# Altium project PCB Project.PrjPcb
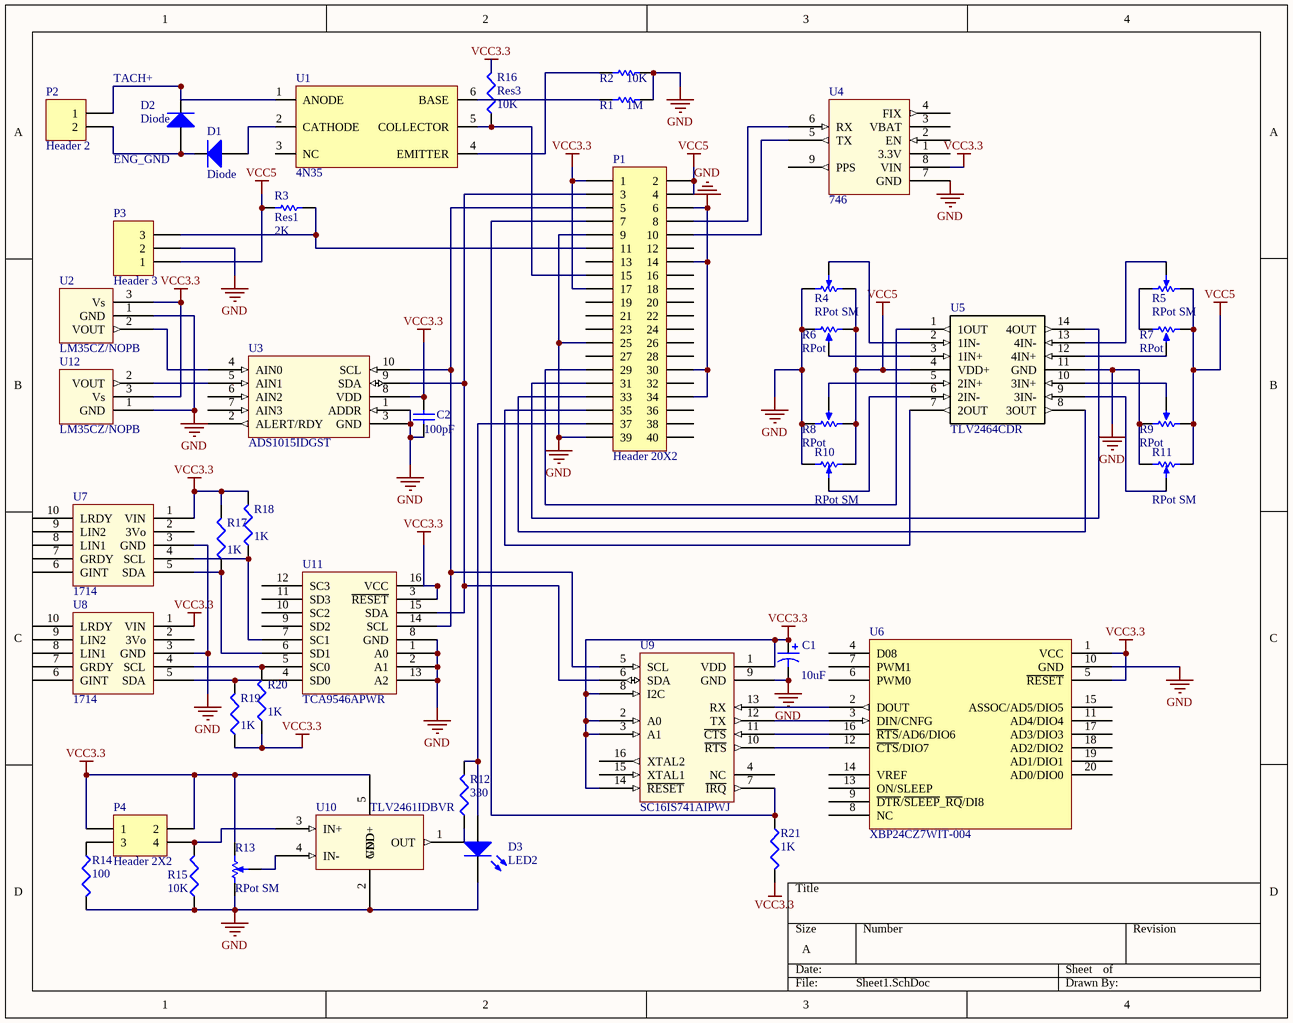
[diagram p0: Sheet1.SchDoc]
1 sheet, 42 parts. Net scope: global (net labels, ports and power ports of the same name join across sheets).
Board file: PCB1.PcbDoc

## Sheet Sheet1.SchDoc
size A

### Parts
C1  value 10uF  [C0805]  (hidden comment: Cap Pol3)
C2  value 100pF  [1608[0603]]  (hidden comment: Cap Semi)
D1  Diode  [DIODE-0.4]
D2  Diode  [DIODE-0.4]
D3  LED2  [3.2X1.6X1.1]
P1  Header 20X2  [HDR2X20]
P2  Header 2  [HDR1X2]
P3  Header 3  [HDR1X3]
P4  Header 2X2  [HDR2X2]
R1  value 1M  [0402]  (hidden comment: Res1)
R2  value 10K  [0402]  (hidden comment: Res1)
R3  Res1  value 2K  [0402]
R4  RPot SM  [23BR10KLFTR]
R5  RPot SM  [23BR10KLFTR]
R6  RPot  [VR5]
R7  RPot  [VR5]
R8  RPot  [VR5]
R9  RPot  [VR5]
R10  RPot SM  [23BR10KLFTR]
R11  RPot SM  [23BR10KLFTR]
R12  value 330  [0402]  (hidden comment: Res3)
R13  RPot SM  [23BR10KLFTR]
R14  value 100  [0402]  (hidden comment: Res3)
R15  value 10K  [0402]  (hidden comment: Res3)
R16  Res3  value 10K  [0402]
R17  value 1K  [J1-0603]  (hidden comment: Res3)
R18  value 1K  [J1-0603]  (hidden comment: Res3)
R19  value 1K  [J1-0603]  (hidden comment: Res3)
R20  value 1K  [J1-0603]  (hidden comment: Res3)
R21  value 1K  [J1-0603]  (hidden comment: Res3)
U1  4N35  [4N35]
U2  LM35CZ/NOPB  [HDR1X3]
U3  ADS1015IDGST  [ADS1015IDGST]
U4  746  [HDR1X9]
U5  TLV2464CDR  [TLV2464CDR]
U6  XBP24CZ7WIT-004  [XBP24CZ7WIT-004]
U7  1714  [HDR1X10]
U8  1714  [HDR1X10]
U9  SC16IS741AIPWJ  [SC16IS741AIPWJ]
U10  TLV2461IDBVR  [TLV2461IDBVR]
U11  TCA9546APWR  [TCA9546APWR]
U12  LM35CZ/NOPB  [HDR1X3]

### Nets
GND: C1.2 C2.1 D3.2(K) P1.6 P1.9 P1.14 P1.25 P1.30 P1.34 P1.39 P3.2 R1.1 R2.1 R4.1 R6.1(TOP) R8.2(BOT) R9.2(BOT) R10.3 R11.3 R13.3 R14.2 R15.1 U2.1(GND) U3.1(ADDR) U3.3(GND) U4.7(GND) U5.11(GND) U6.10(GND) U7.3(GND) U8.3(GND) U9.9(GND) U10.2(GND) U11.1(A0) U11.2(A1) U11.8(GND) U11.13(A2) U12.1(GND)
VCC3.3: C1.1 C2.2 P1.1 P1.17 P4.1 P4.2 R13.1 R16.2 R17.2 R18.2 R19.1 R20.1 R21.2 U2.3(Vs) U3.8(VDD) U4.8(VIN) U6.1(VCC) U6.5(~{RESET}) U7.1(VIN) U8.1(VIN) U9.1(VDD) U9.2(A0) U9.3(A1) U9.8(I2C) U9.14(~{RESET}) U10.5(VDD+) U11.3(~{RESET}) U11.16(VCC) U12.3(Vs)
VCC5: P1.2 P1.4 P3.1 R3.1 R4.3 R5.3 R6.2(BOT) R7.2(BOT) R8.1(TOP) R9.1(TOP) R10.1 R11.1 U5.4(VDD+)
NetD1_1: D1.1(A) U1.2(CATHODE)
NetD1_2: D1.2(K) D2.1(A) P2.2
NetD2_2: D2.2(K) P2.1 U1.1(ANODE)
NetD3_1: D3.1(A) P1.37 R12.2
NetP1_3: P1.3 U3.9(SDA) U9.6(SDA) U11.15(SDA)
NetP1_5: P1.5 U3.10(SCL) U9.5(SCL) U11.14(SCL)
NetP1_7: P1.7 R21.1 U9.7(~{IRQ})
NetP1_8: P1.8 U4.6(RX)
NetP1_10: P1.10 U4.5(TX)
NetP1_11: P1.11 P3.3 R3.2
NetP1_15: P1.15 R16.1 U1.5(COLLECTOR)
NetP1_29: P1.29 U5.1(1OUT)
NetP1_31: P1.31 U5.14(4OUT)
NetP1_33: P1.33 U5.8(3OUT)
NetP1_35: P1.35 U5.7(2OUT)
NetP4_3: P4.3 R14.1
NetP4_4: P4.4 R15.2 U10.3(IN+)
NetR1_2: R1.2 U1.6(BASE)
NetR2_2: R2.2 U1.4(EMITTER)
NetR4_2: R4.2 U5.2(1IN-)
NetR5_1: R5.1 R7.1(TOP)
NetR5_2: R5.2 U5.13(4IN-)
NetR6_3: R6.3(TAP) U5.3(1IN+)
NetR7_3: R7.3(TAP) U5.12(4IN+)
NetR8_3: R8.3(TAP) U5.5(2IN+)
NetR9_3: R9.3(TAP) U5.10(3IN+)
NetR10_2: R10.2 U5.6(2IN-)
NetR11_2: R11.2 U5.9(3IN-)
NetR12_1: R12.1 U10.1(OUT)
NetR13_2: R13.2 U10.4(IN-)
NetR17_1: R17.1 U7.5(SDA) U11.6(SD1)
NetR18_1: R18.1 U7.4(SCL) U11.7(SC1)
NetR19_2: R19.2 U8.5(SDA) U11.4(SD0)
NetR20_2: R20.2 U8.4(SCL) U11.5(SC0)
NetU2_2: U2.2(VOUT) U3.4(AIN0)
NetU3_5: U3.5(AIN1) U12.2(VOUT)
NetU6_2: U6.2(DOUT) U9.13(RX)
NetU6_3: U6.3(DIN/CNFG) U9.12(TX)
NetU6_12: U6.12(~{CTS}/DIO7) U9.10(~{RTS})
NetU6_16: U6.16(~{RTS}/AD6/DIO6) U9.11(~{CTS})

Not connected (* = marked no-connect by the designer): P1 12 13 16 18 19 20 21 22 23 24 26 27 28 32 36 38 40; U1 3(NC); U3 2(ALERT/RDY) 6(AIN2) 7(AIN3); U4 1(3.3V) 2(EN) 3(VBAT) 4(FIX) 9(PPS); U6 4(D08) 6(PWM0) 7(PWM1) 8(NC) 9(~{DTR}/~{SLEEP}_~{RQ}/DI8) 11(AD4/DIO4) 13(ON/SLEEP) 14(VREF) 15(ASSOC/AD5/DIO5) 17(AD3/DIO3) 18(AD2/DIO2) 19(AD1/DIO1) 20(AD0/DIO0); U7 2(3Vo) 6(GINT) 7(GRDY) 8(LIN1) 9(LIN2) 10(LRDY); U8 2(3Vo) 6(GINT) 7(GRDY) 8(LIN1) 9(LIN2) 10(LRDY); U9 4(NC) 15(XTAL1) 16(XTAL2); U11 9(SD2) 10(SC2) 11(SD3) 12(SC3)

### Notes on the sheet
- TACH+
- ENG_GND

### Library data of the parts
C1 = Cap Pol3: Polarized Capacitor (Surface Mount); Published: 8-Jun-2000; LatestRevisionDate: 29-May-2009; LatestRevisionNote: IPC-7351 Footprint Added.; PackageReference: C0805; Publisher: Altium Limited; PackageDescription: Chip Capacitor
C2 = Cap Semi: Capacitor (Semiconductor SIM Model); Published: 8-Jun-2000; LatestRevisionDate: 29-May-2009; LatestRevisionNote: IPC-7351 Footprint Added.; PackageReference: C1206; Publisher: Altium Limited; PackageDescription: Chip Capacitor
D1 D2 = Diode: Default Diode; Published: 8-Jun-2000; LatestRevisionDate: 17-Jul-2002; LatestRevisionNote: Re-released for DXP Platform.; PackageVersion: Sep-1996; PackageReference: SMC; Publisher: Altium Limited; PackageDescription: DO-214-AB/SMC; 2 C-Bend Leads; Body 7.9 x 5.9 mm, inc. leads (LxW); Code_JEDEC: DO-214-AB
D3 = LED2: Typical RED, GREEN, YELLOW, AMBER GaAs LED; Published: 8-Jun-2000; LatestRevisionDate: 17-Jul-2002; LatestRevisionNote: Re-released for DXP Platform.; PackageVersion: Feb-2002; PackageReference: 3.2X1.6X1.1; Publisher: Altium Limited; PackageDescription: SM LED; 2 Flat Leads
P1 = Header 20X2: Header, 20-Pin, Dual row; LatestRevisionDate: 17-Jul-2002; LatestRevisionNote: Re-released for DXP Platform.; Publisher: Altium Limited
P2 = Header 2: Header, 2-Pin; LatestRevisionDate: 17-Jul-2002; LatestRevisionNote: Re-released for DXP Platform.; Publisher: Altium Limited
P3 = Header 3: Header, 3-Pin; LatestRevisionDate: 17-Jul-2002; LatestRevisionNote: Re-released for DXP Platform.; Publisher: Altium Limited
P4 = Header 2X2: Header, 2-Pin, Dual row; LatestRevisionDate: 17-Jul-2002; LatestRevisionNote: Re-released for DXP Platform.; Publisher: Altium Limited
R1-R3 = Res1: Resistor; Published: 8-Jun-2000; LatestRevisionDate: 17-Jul-2002; LatestRevisionNote: Re-released for DXP Platform.; PackageReference: AXIAL-0.3; Publisher: Altium Limited; PackageDescription: Axial Device, Thru-Hole; 2 Leads; 0.3 in Pin Spacing
R4 R5 R10 R11 R13 = RPot SM: Square Trimming Potentiometer; Published: 17-Dec-2003; DatasheetVersion: Oct-2003; PackageReference: POT4MM-2; Publisher: Altium Limited; PackageDescription: Square Trimming Potentiometer; ComponentLink1Description: Manufacturer Link; ComponentLink1URL: http://bourns.com/2/search.html
R6-R9 = RPot: Potentiometer; Sim Note: Enter the Resistance value and the set point into parameter fields.; Set Position: 0.5; Value: 10K; Published: 8-Jun-2000; LatestRevisionDate: 17-Jul-2002; LatestRevisionNote: Re-released for DXP Platform.; PackageReference: VR5; Publisher: Altium Limited; PackageDescription: Variable Resistor, Thru-Hole; 3 Leads
R12 R14-R21 = Res3: Resistor; Published: 8-Jun-2000; LatestRevisionDate: 29-May-2009; LatestRevisionNote: IPC-7351 Footprint Added.; PackageReference: J1-0603; Publisher: Altium Limited; PackageDescription: Chip Resistor
U1 = 4N35: OPTOISO 3.55KV TRANS W/BASE 6DIP; Mfr 1: Lite-On Inc.; Mfr 1 PN: 4N35
U2 U12 = LM35CZ/NOPB: SENSOR TEMP ANLG VOLT TO-92-3; Mfr 1: Texas Instruments; Mfr 1 PN: LM35CZ/NOPB
U3 = ADS1015IDGST: IC ADC 12BIT I2C W/REF 10-MSOP; Mfr 1: Texas Instruments; Mfr 1 PN: ADS1015IDGST
U4 = 746: GPS BREAKOUT 66CH W/10HZ UPDATES; Mfr 1: Adafruit; Mfr 1 PN: 746
U5 = TLV2464CDR: IC OPAMP GP 6.4MHZ RRO 14SOIC; Vendor: Texas Instruments; Built_By: EMA_UL_Team; C: Copyright (C) 2015 Accelerated Designs. All rights reserved; Manufacturer_Part_Number: TLV2464CDR; Value: Value; Type: Type; RefDes: RefDes
U6 = XBP24CZ7WIT-004: RF TXRX MODULE 802.15.4 WIRE ANT; Mfr 1: Digi International; Mfr 1 PN: XBP24CZ7WIT-004; Notes: *
U7 U8 = 1714: 9-DOF IMU BREAKOUT BRD; Mfr 1: Adafruit; Mfr 1 PN: 1714; Notes: *
U9 = SC16IS741AIPWJ: IC UART SGL I2C BUS SPI 16TSSOP; Mfr 1: NXP USA Inc.; Mfr 1 PN: SC16IS741AIPWJ
U10 = TLV2461IDBVR: IC OPAMP GP 6.4MHZ RRO SOT23-5; Mfr 1: Texas Instruments; Mfr 1 PN: TLV2461IDBVR
U11 = TCA9546APWR: IC I2C SW 4CH W/RESET 16TSSOP; Mfr 1: Texas Instruments; Mfr 1 PN: TCA9546APWR